# EAGLE schematic cpl2 (EAGLE 5.10)
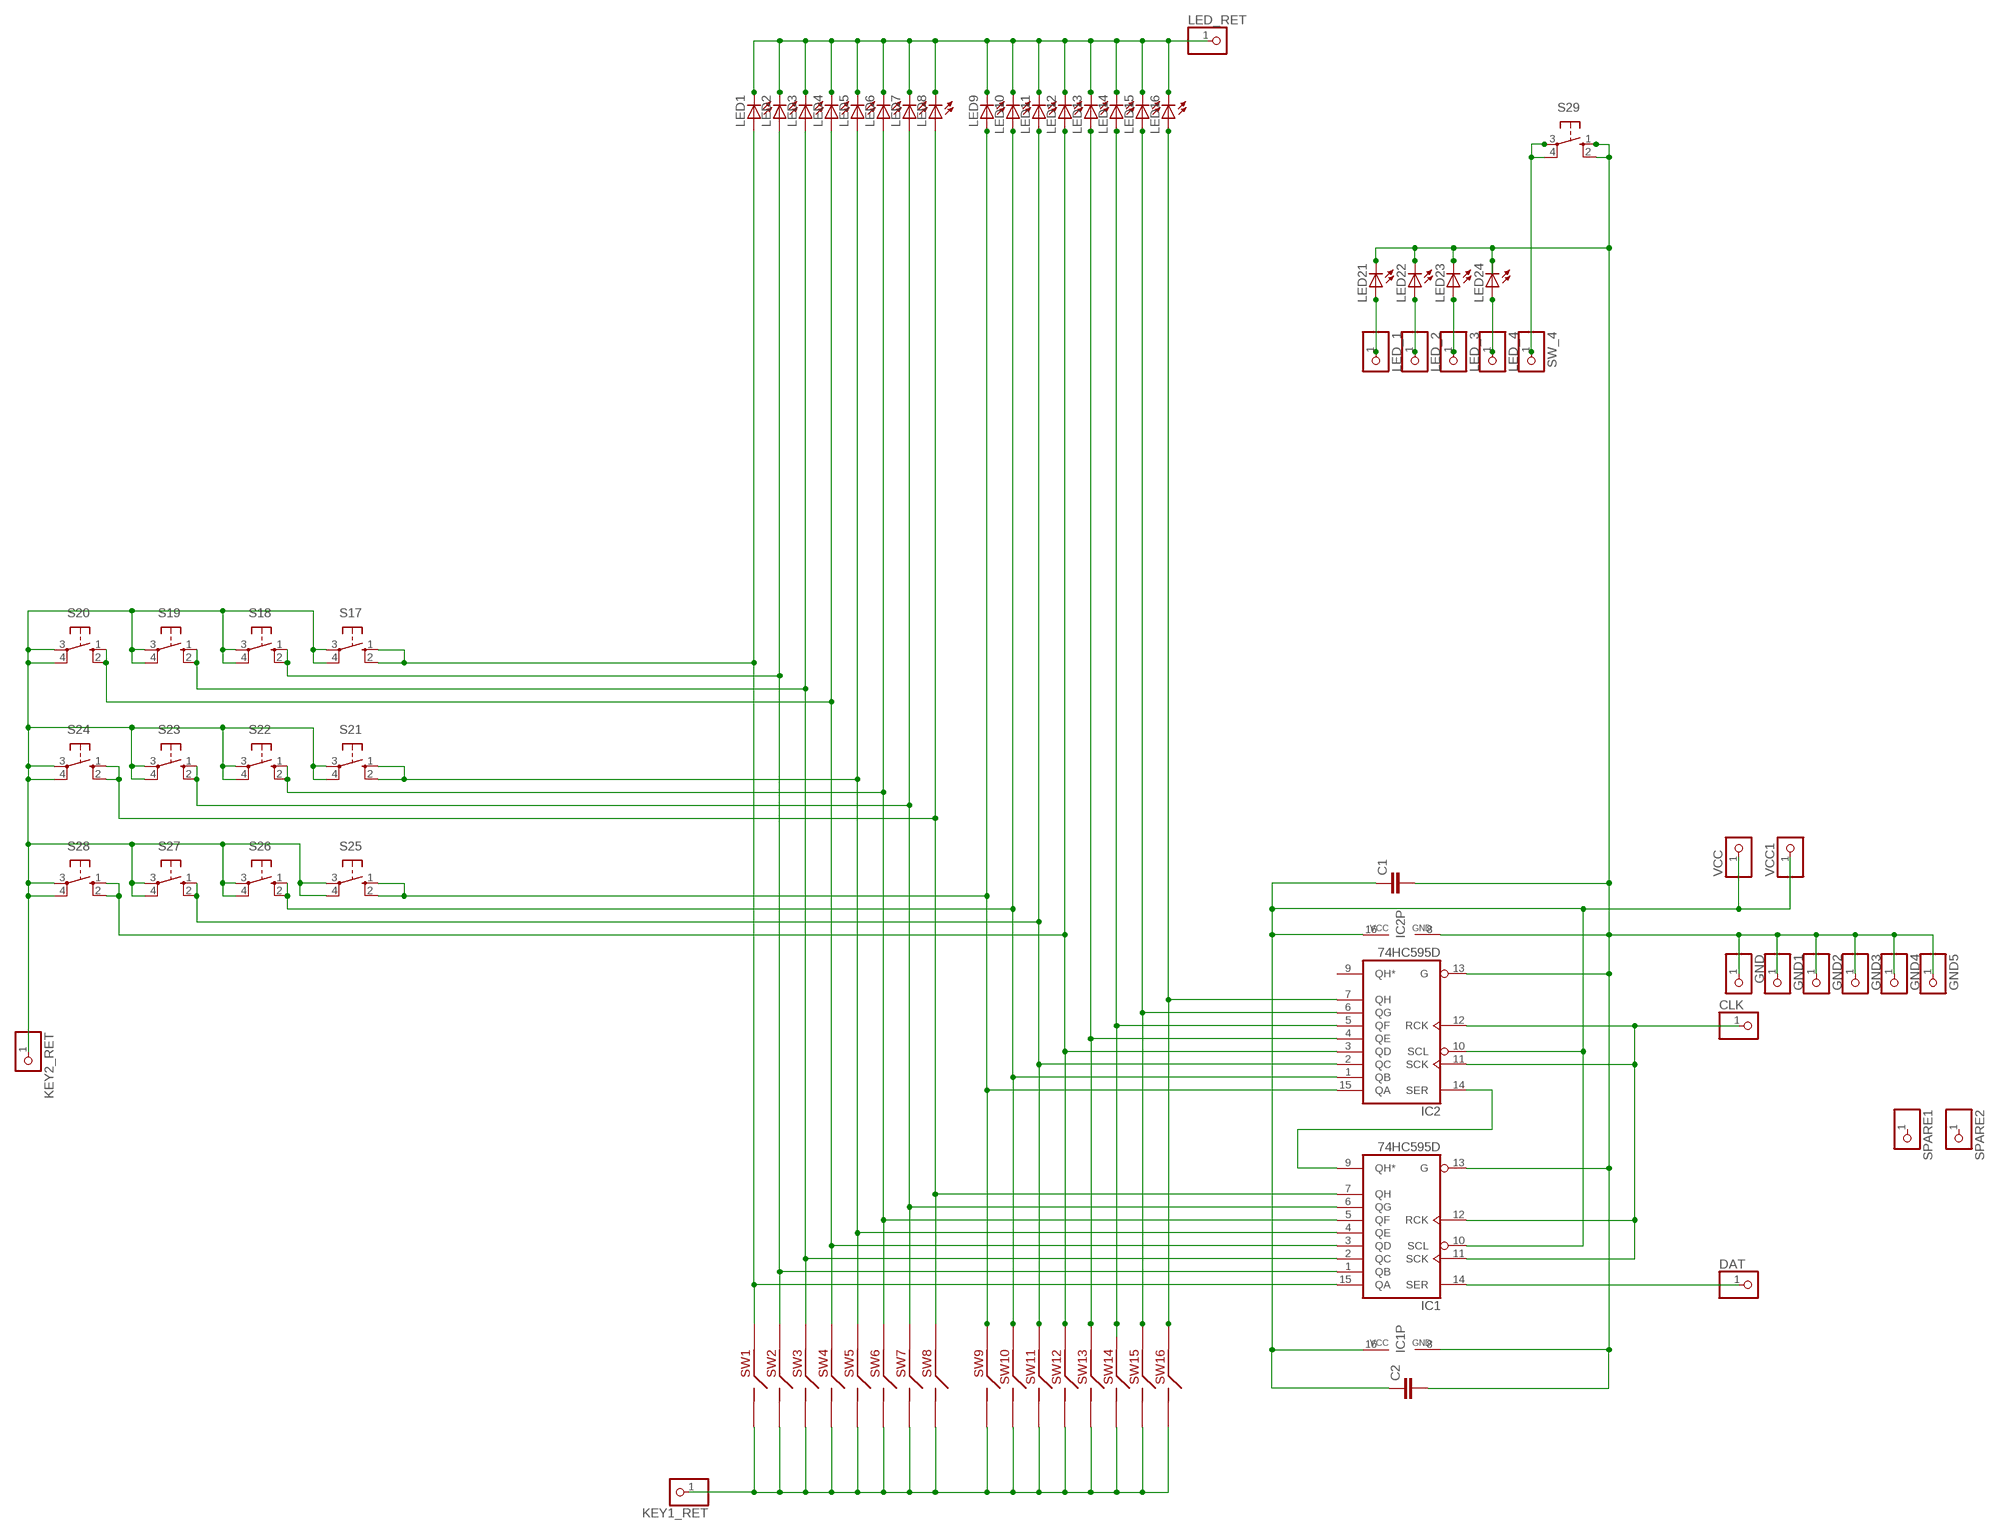
[diagram p0: schematic, sheet 1]

## Parts
C1  C-EUC0805  [C0805]
C2  C-EUC0805  [C0805]
CLK  PINHD-1X1  [1X01]
DAT  PINHD-1X1  [1X01]
GND  PINHD-1X1  [1X01]
GND1  PINHD-1X1  [1X01]
GND2  PINHD-1X1  [1X01]
GND3  PINHD-1X1  [1X01]
GND4  PINHD-1X1  [1X01]
GND5  PINHD-1X1  [1X01]
IC1  74HC595D  [SO16]
IC2  74HC595D  [SO16]
KEY1_RET  PINHD-1X1  [1X01]
KEY2_RET  PINHD-1X1  [1X01]
LED1  LED3MM  [LED3MM]
LED2  LED3MM  [LED3MM]
LED3  LED3MM  [LED3MM]
LED4  LED3MM  [LED3MM]
LED5  LED3MM  [LED3MM]
LED6  LED3MM  [LED3MM]
LED7  LED3MM  [LED3MM]
LED8  LED3MM  [LED3MM]
LED9  LED3MM  [LED3MM]
LED10  LED3MM  [LED3MM]
LED11  LED3MM  [LED3MM]
LED12  LED3MM  [LED3MM]
LED13  LED3MM  [LED3MM]
LED14  LED3MM  [LED3MM]
LED15  LED3MM  [LED3MM]
LED16  LED3MM  [LED3MM]
LED21  LED3MM  [LED3MM]
LED22  LED3MM  [LED3MM]
LED23  LED3MM  [LED3MM]
LED24  LED3MM  [LED3MM]
LED_1  PINHD-1X1  [1X01]
LED_2  PINHD-1X1  [1X01]
LED_3  PINHD-1X1  [1X01]
LED_4  PINHD-1X1  [1X01]
LED_RET  PINHD-1X1  [1X01]
S17  10-XX  [B3F-10XX]
S18  10-XX  [B3F-10XX]
S19  10-XX  [B3F-10XX]
S20  10-XX  [B3F-10XX]
S21  10-XX  [B3F-10XX]
S22  10-XX  [B3F-10XX]
S23  10-XX  [B3F-10XX]
S24  10-XX  [B3F-10XX]
S25  10-XX  [B3F-10XX]
S26  10-XX  [B3F-10XX]
S27  10-XX  [B3F-10XX]
S28  10-XX  [B3F-10XX]
S29  10-XX  [B3F-10XX]
SPARE1  PINHD-1X1  [1X01]
SPARE2  PINHD-1X1  [1X01]
SW1  3MMTACTSW  [3MMTACTSW]
SW2  3MMTACTSW  [3MMTACTSW]
SW3  3MMTACTSW  [3MMTACTSW]
SW4  3MMTACTSW  [3MMTACTSW]
SW5  3MMTACTSW  [3MMTACTSW]
SW6  3MMTACTSW  [3MMTACTSW]
SW7  3MMTACTSW  [3MMTACTSW]
SW8  3MMTACTSW  [3MMTACTSW]
SW9  3MMTACTSW  [3MMTACTSW]
SW10  3MMTACTSW  [3MMTACTSW]
SW11  3MMTACTSW  [3MMTACTSW]
SW12  3MMTACTSW  [3MMTACTSW]
SW13  3MMTACTSW  [3MMTACTSW]
SW14  3MMTACTSW  [3MMTACTSW]
SW15  3MMTACTSW  [3MMTACTSW]
SW16  3MMTACTSW  [3MMTACTSW]
SW_4  PINHD-1X1  [1X01]
VCC  PINHD-1X1  [1X01]
VCC1  PINHD-1X1  [1X01]

## Nets
GND: C1.2 C2.2 GND1.1 GND2.1 GND3.1 GND4.1 GND5.1 GND.1 IC1.8(GND) IC1.13(G) IC2.8(GND) IC2.13(G) LED21.K(C) LED22.K(C) LED23.K(C) LED24.K(C) S29.1(S) S29.2(S1)
N$1: IC1.15(QA) LED1.A S17.1(S) S17.2(S1) SW1.P$1
N$2: IC1.1(QB) LED2.A S18.1(S) S18.2(S1) SW2.P$1
N$3: IC1.2(QC) LED3.A S19.1(S) S19.2(S1) SW3.P$1
N$4: IC1.3(QD) LED4.A S20.1(S) S20.2(S1) SW4.P$1
N$5: IC1.4(QE) LED5.A S21.1(S) S21.2(S1) SW5.P$1
N$6: IC1.5(QF) LED6.A S22.1(S) S22.2(S1) SW6.P$1
N$7: IC1.6(QG) LED7.A S23.1(S) S23.2(S1) SW7.P$1
N$8: IC1.7(QH) LED8.A S24.1(S) S24.2(S1) SW8.P$1
N$9: IC2.15(QA) LED9.A S25.1(S) S25.2(S1) SW9.P$1
N$11: KEY1_RET.1 SW1.P$2 SW2.P$2 SW3.P$2 SW4.P$2 SW5.P$2 SW6.P$2 SW7.P$2 SW8.P$2 SW9.P$2 SW10.P$2 SW11.P$2 SW12.P$2 SW13.P$2 SW14.P$2 SW15.P$2 SW16.P$2
N$12: IC2.1(QB) LED10.A S26.1(S) S26.2(S1) SW10.P$1
N$14: CLK.1 IC1.11(SCK) IC1.12(RCK) IC2.11(SCK) IC2.12(RCK)
N$15: DAT.1 IC1.14(SER)
N$18: LED1.K(C) LED2.K(C) LED3.K(C) LED4.K(C) LED5.K(C) LED6.K(C) LED7.K(C) LED8.K(C) LED9.K(C) LED10.K(C) LED11.K(C) LED12.K(C) LED13.K(C) LED14.K(C) LED15.K(C) LED16.K(C) LED_RET.1
N$19: KEY2_RET.1 S17.3(P) S17.4(P1) S18.3(P) S18.4(P1) S19.3(P) S19.4(P1) S20.3(P) S20.4(P1) S21.3(P) S21.4(P1) S22.3(P) S22.4(P1) S23.3(P) S23.4(P1) S24.3(P) S24.4(P1) S25.3(P) S25.4(P1) S26.3(P) S26.4(P1) S27.3(P) S27.4(P1) S28.3(P) S28.4(P1)
N$20: LED21.A LED_1.1
N$22: LED22.A LED_2.1
N$23: LED23.A LED_3.1
N$24: LED24.A LED_4.1
N$26: S29.3(P) S29.4(P1) SW_4.1
N$28: IC2.3(QD) LED12.A S28.1(S) S28.2(S1) SW12.P$1
N$30: IC1.9(QH*) IC2.14(SER)
N$35: IC2.4(QE) LED13.A SW13.P$1
N$36: IC2.2(QC) LED11.A S27.1(S) S27.2(S1) SW11.P$1
N$37: IC2.5(QF) LED14.A SW14.P$1
N$38: IC2.6(QG) LED15.A SW15.P$1
N$39: IC2.7(QH) LED16.A SW16.P$1
VCC: C1.1 C2.1 IC1.10(SCL) IC1.16(VCC) IC2.10(SCL) IC2.16(VCC) VCC1.1 VCC.1
Unconnected: IC2.9(QH*) SPARE1.1 SPARE2.1

## Library data of the parts
C1 C2 = rcl:C-EU: CAPACITOR, European symbol
CLK DAT GND GND1-GND5 KEY1_RET KEY2_RET LED_1-LED_4 LED_RET SPARE1 SPARE2 SW_4 VCC VCC1 = adafruit:PINHD-1X1: Pin header 1x1 for 0.1" spacing With round pins
IC1 IC2 = 74xx-eu:74*595: 8-bit SHIFT REGISTER, output latch
LED1-LED16 LED21-LED24 = adafruit:LED: LED OSRAM: - CHIPLED LG R971, LG N971, LY N971, LG Q971, LY Q971, LO R971, LY R971 LH N974, LH R974 LS Q976, LO Q976, LY Q976 LO Q996 - Hyper CHIPLED LW Q18S LB Q993, LB Q99A, LB R99A - SideLED LS A670, LO A670, LY A670, LG A670, LP A670 LB A673, LV A673, LT A673, LW A673 LH A674 LY A675 LS A676, LA A676, LO A676, LY A676, LW A676 LS A679, LY A679, LG A679 - Hyper Micro SIDELED® LS Y876, LA Y876, LO Y876, LY Y876 LT Y87S - SmartLED LW L88C, LW L88S LB L89C, LB L89S, LG L890 LS L89K, LO L89K, LY L89K LS L896, LA L896, LO L896, LY L896 - TOPLED LS T670, LO T670, LY T670, LG T670, LP T670 LSG T670, LSP T670, LSY T670, LOP T670, LYG T670 LG T671, LOG T671, LSG T671 LB T673, LV T673, LT T673, LW T673 LH T674 LS T676, LA T676, LO T676, LY T676, LB T676, LH T676, LSB T676, LW T676 LB T67C, LV T67C, LT T67C, LS T67K, LO T67K, LY T67K, LW E67C LS E67B, LA E67B, LO E67B, LY E67B, LB E67C, LV E67C, LT E67C LW T67C LS T679, LY T679, LG T679 LS T770, LO T770, LY T770, LG T770, LP T770 LB T773, LV T773, LT T773, LW T773 LH T774 LS E675, LA E675, LY E675, LS T675 LS T776, LA T776, LO T776, LY T776, LB T776 LHGB T686 LT T68C, LB T68C - Hyper Mini TOPLED® LB M676 - Mini TOPLED Santana® LG M470 LS M47K, LO M47K, LY M47K Source: http://www.osram.convergy.de/
S17-S29 = switch-omron:10-XX: OMRON SWITCH
SW1-SW16 = jasons_stuff:3MMTACTSW